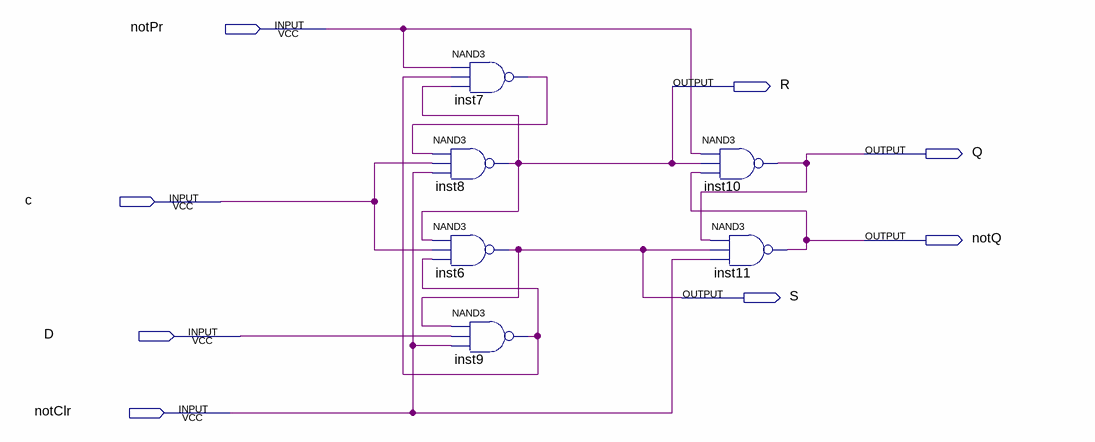
[diagram p0: schematic sheet]
// Quartus schematic D-tr.bdf as structural Verilog: 6 symbols, 8 pins
module \D-tr  (
  input  notPr,
  input  c,
  input  D,
  input  notClr,
  output R,
  output Q,
  output notQ,
  output S
);

  wire inst7_out, inst9_out;

  nand inst7 (inst7_out, notPr, inst9_out, R);
  nand inst8 (R, inst7_out, c, notClr);
  nand inst6 (S, R, c, inst9_out);
  nand inst9 (inst9_out, S, D, notClr);
  nand inst10 (Q, notPr, R, notQ);
  nand inst11 (notQ, Q, S, notClr);
endmodule
